# EAGLE design gsm_module (EAGLE 6.4)
PARTNAME: gsm_module; REVISION: 3.0
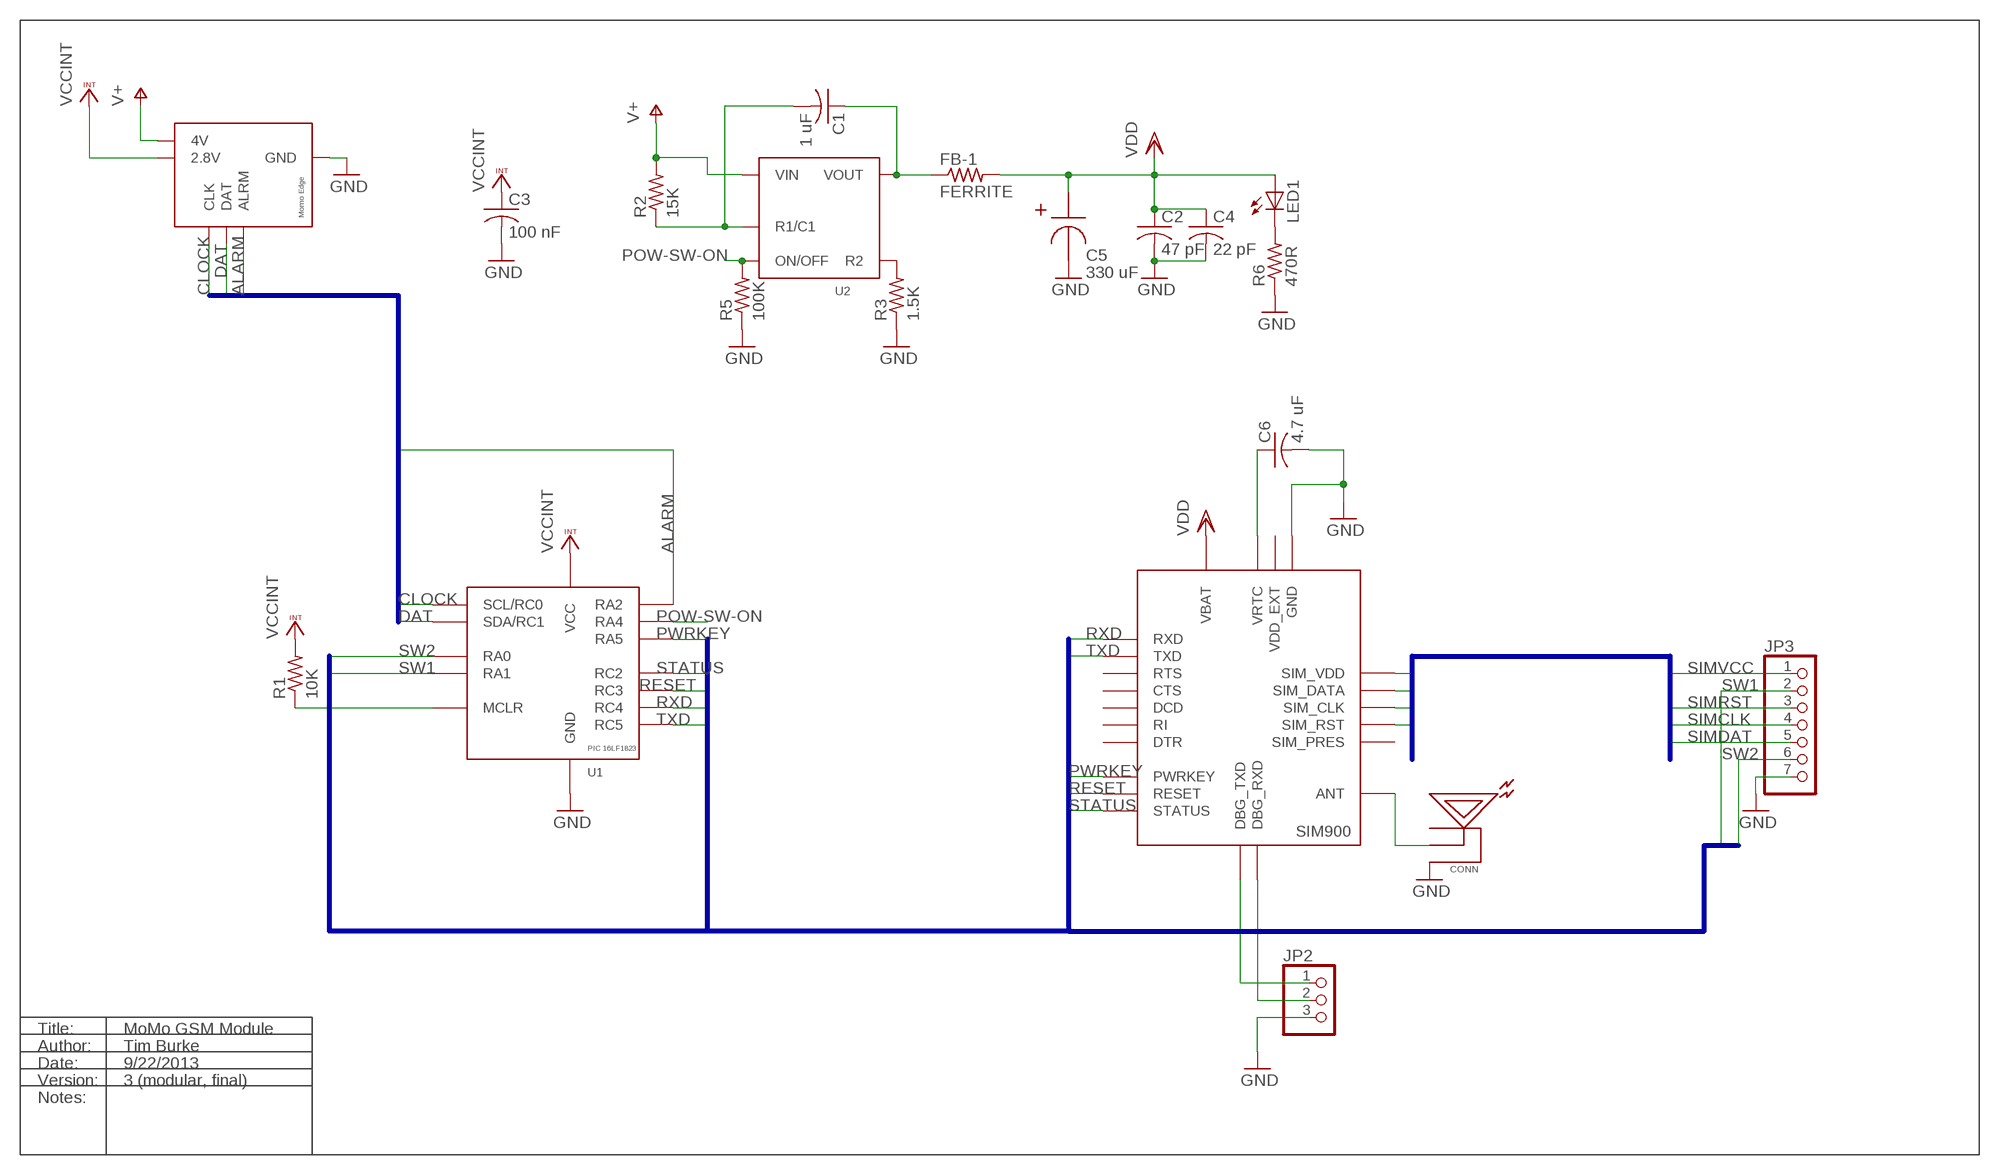
[diagram p0: schematic, sheet 1]

## Parts
C1  1 uF  C-USC0402K  [C0402K]
C2  47 pF  C-USC0402K  [C0402K]
C3  100 nF  C-USC0402  [C0402]
C4  22 pF  C-USC0402K  [C0402K]
C5  330 uF  TANTALUM_CAP  [2917]
C6  4.7 uF  C-USC0805  [C0805]
CONN  RFANTENNA  [RFJACK]
FB-1  FERRITE  R-US_R0805  [R0805]
JP1  MOMO-EDGE-6M  [MOMO-EDGE-6M]
JP2  PINHD-1X3  [1X03]
JP3  PINHD-1X7  [1X07]
LED1  LEDCHIPLED_0603  [CHIPLED_0603]
R1  10K  R-US_R0603  [R0603]
R2  15K  R-US_R0603  [R0603]
R3  1.5K  R-US_R0603  [R0603]
R5  100K  R-US_R0603  [R0603]
R6  470R  R-US_R0603  [R0603]
U1  PIC16LF1823  [SO14]
U2  TI-HIGHSIDE-PFET  [SOT23-6L]
U3  SIM900  [SIM900]

## Nets
ALARM: JP1.ALARM(ALRM) U1.11(RA2)
CLOCK: JP1.CLK U1.10(SCL/RC0)
DAT: JP1.DAT U1.9(SDA/RC1)
DEBUGRX: JP2.2 U3.28(DBG_RXD)
DEBUGTX: JP2.1 U3.27(DBG_TXD)
GND: C2.2 C3.2 C4.2 C5.- C6.2 CONN.UNUSED1(SHIELD) CONN.UNUSED2(SHIELD) JP1.GND JP2.3 JP3.7 R3.1 R5.1 R6.1 U1.14(GND) U3.17(GND) U3.18(GND) U3.29(GND) U3.39(GND) U3.45(GND) U3.46(GND) U3.53(GND) U3.54(GND) U3.58(GND) U3.59(GND) U3.61(GND) U3.62(GND) U3.63(GND) U3.64(GND) U3.65(GND)
N$1: R3.2 U2.1(R2)
N$2: LED1.C R6.2
N$3: C1.2 R2.1 U2.6(R1/C1)
N$4: C1.1 FB-1.1 U2.2(VOUT) U2.3(VOUT)
N$5: C6.1 U3.26(VRTC)
N$6: R1.1 U1.4(MCLR)
N$7: CONN.ANTENNA(PIN) U3.60(ANT)
POW-SW-ON: R5.2 U1.3(RA4) U2.5(ON/OFF)
PWRKEY: U1.2(RA5) U3.1(PWRKEY)
RESET: U1.7(RC3) U3.16(RESET)
RXD: U1.6(RC4) U3.10(RXD)
SIMCLK: JP3.4 U3.32(SIM_CLK)
SIMDAT: JP3.5 U3.31(SIM_DATA)
SIMRST: JP3.3 U3.33(SIM_RST)
SIMVCC: JP3.1 U3.30(SIM_VDD)
STATUS: U1.8(RC2) U3.66(STATUS)
SW1: JP3.2 U1.12(RA1)
SW2: JP3.6 U1.13(RA0)
TXD: U1.5(RC5) U3.9(TXD)
V+: JP1.4V R2.2 U2.4(VIN)
VCCINT: C3.1 JP1.V28(2.8V) R1.2 U1.1(VCC)
VDD: C2.1 C4.1 C5.+ FB-1.2 LED1.A U3.55(VBAT) U3.56(VBAT) U3.57(VBAT)
Unconnected: U3.3(DTR) U3.4(RI) U3.5(DCD) U3.7(CTS) U3.8(RTS) U3.34(SIM_PRES)

## Buses
MIB:CLOCK,DAT,PMCLR,ALARM
SIMBUS:SIMVCC,SIMCLK,SIMDAT,SIMRST
SIM900CONN:RXD,TXD,PWRKEY,RESET,STATUS,SW1,SW2

## Notes on the sheet
- Title: | MoMo GSM Module
- Author: | Tim Burke
- Date: | 9/22/2013
- Version: | 3 (modular, final)
- Notes:

## Power pins joined to a net without a drawn wire
VDD_EXT: U3.15(VDD_EXT)

## Library data of the parts
C1 = rcl:C-US: CAPACITOR, American symbol; DIGIKEY-PN: 445-4114-1-ND
C2 = rcl:C-US: CAPACITOR, American symbol; DIGIKEY-PN: 445-1243-1-ND
C3 = rcl:C-US: CAPACITOR, American symbol; DIGIKEY-PN: 445-1265-1-ND
C4 = rcl:C-US: CAPACITOR, American symbol; DIGIKEY-PN: 445-1239-1-ND
C5 = components:TANTALUM_CAP; DIGIKEY-PN: 399-4053-1-ND
C6 = rcl:C-US: CAPACITOR, American symbol; DIGIKEY-PN: 1276-1259-1-ND
CONN = components:RFANTENNA; DIGIKEY-PN: J983CT-ND
FB-1 = rcl:R-US_: RESISTOR, American symbol; DIGIKEY-PN: 445-1567-1-ND
JP1 = components:MOMO-EDGE-6M; DIGIKEY-PN: 609-3327-ND
JP2 = pinhead:PINHD-1X3: PIN HEADER
JP3 = pinhead:PINHD-1X7: PIN HEADER
LED1 = led:LED: LED OSRAM: - CHIPLED LG R971, LG N971, LY N971, LG Q971, LY Q971, LO R971, LY R971 LH N974, LH R974 LS Q976, LO Q976, LY Q976 LO Q996 - Hyper CHIPLED LW Q18S LB Q993, LB Q99A, LB R99A - SideLED LS A670, LO A670, LY A670, LG A670, LP A670 LB A673, LV A673, LT A673, LW A673 LH A674 LY A675 LS A676, LA A676, LO A676, LY A676, LW A676 LS A679, LY A679, LG A679 - Hyper Micro SIDELED® LS Y876, LA Y876, LO Y876, LY Y876 LT Y87S - SmartLED LW L88C, LW L88S LB L89C, LB L89S, LG L890 LS L89K, LO L89K, LY L89K LS L896, LA L896, LO L896, LY L896 - TOPLED LS T670, LO T670, LY T670, LG T670, LP T670 LSG T670, LSP T670, LSY T670, LOP T670, LYG T670 LG T671, LOG T671, LSG T671 LB T673, LV T673, LT T673, LW T673 LH T674 LS T676, LA T676, LO T676, LY T676, LB T676, LH T676, LSB T676, LW T676 LB T67C, LV T67C, LT T67C, LS T67K, LO T67K, LY T67K, LW E67C LS E67B, LA E67B, LO E67B, LY E67B, LB E67C, LV E67C, LT E67C LW T67C LS T679, LY T679, LG T679 LS T770, LO T770, LY T770, LG T770, LP T770 LB T773, LV T773, LT T773, LW T773 LH T774 LS E675, LA E675, LY E675, LS T675 LS T776, LA T776, LO T776, LY T776, LB T776 LHGB T686 LT T68C, LB T68C - Hyper Mini TOPLED® LB M676 - Mini TOPLED Santana® LG M470 LS M47K, LO M47K, LY M47K Source: http://www.osram.convergy.de LUXEON: - LUMILED® LXK2-PW12-R00, LXK2-PW12-S00, LXK2-PW14-U00, LXK2-PW14-V00 LXK2-PM12-R00, LXK2-PM12-S00, LXK2-PM14-U00 LXK2-PE12-Q00, LXK2-PE12-R00, LXK2-PE12-S00, LXK2-PE14-T00, LXK2-PE14-U00 LXK2-PB12-K00, LXK2-PB12-L00, LXK2-PB12-M00, LXK2-PB14-N00, LXK2-PB14-P00, LXK2-PB14-Q00 LXK2-PR12-L00, LXK2-PR12-M00, LXK2-PR14-Q00, LXK2-PR14-R00 LXK2-PD12-Q00, LXK2-PD12-R00, LXK2-PD12-S00 LXK2-PH12-R00, LXK2-PH12-S00 LXK2-PL12-P00, LXK2-PL12-Q00, LXK2-PL12-R00 Source: www.luxeon.com KINGBRIGHT: KA-3528ASYC Source: www.kingbright.com; DIGIKEY-PN: 475-2709-1-ND
R1 = rcl:R-US_: RESISTOR, American symbol; DIGIKEY-PN: P10.0KHCT-ND
R2 = rcl:R-US_: RESISTOR, American symbol; DIGIKEY-PN: P15KGCT-ND
R3 = rcl:R-US_: RESISTOR, American symbol; DIGIKEY-PN: P1.5KGCT-ND
R5 = rcl:R-US_: RESISTOR, American symbol; DIGIKEY-PN: P100KHCT-ND
R6 = rcl:R-US_: RESISTOR, American symbol
U1 = components:PIC16LF1823; DIGIKEY-PN: PIC16LF1823-I/SL-ND
U2 = components:TI-HIGHSIDE-PFET; DIGIKEY-PN: 296-34970-1-ND
U3 = components:SIM900

## Board
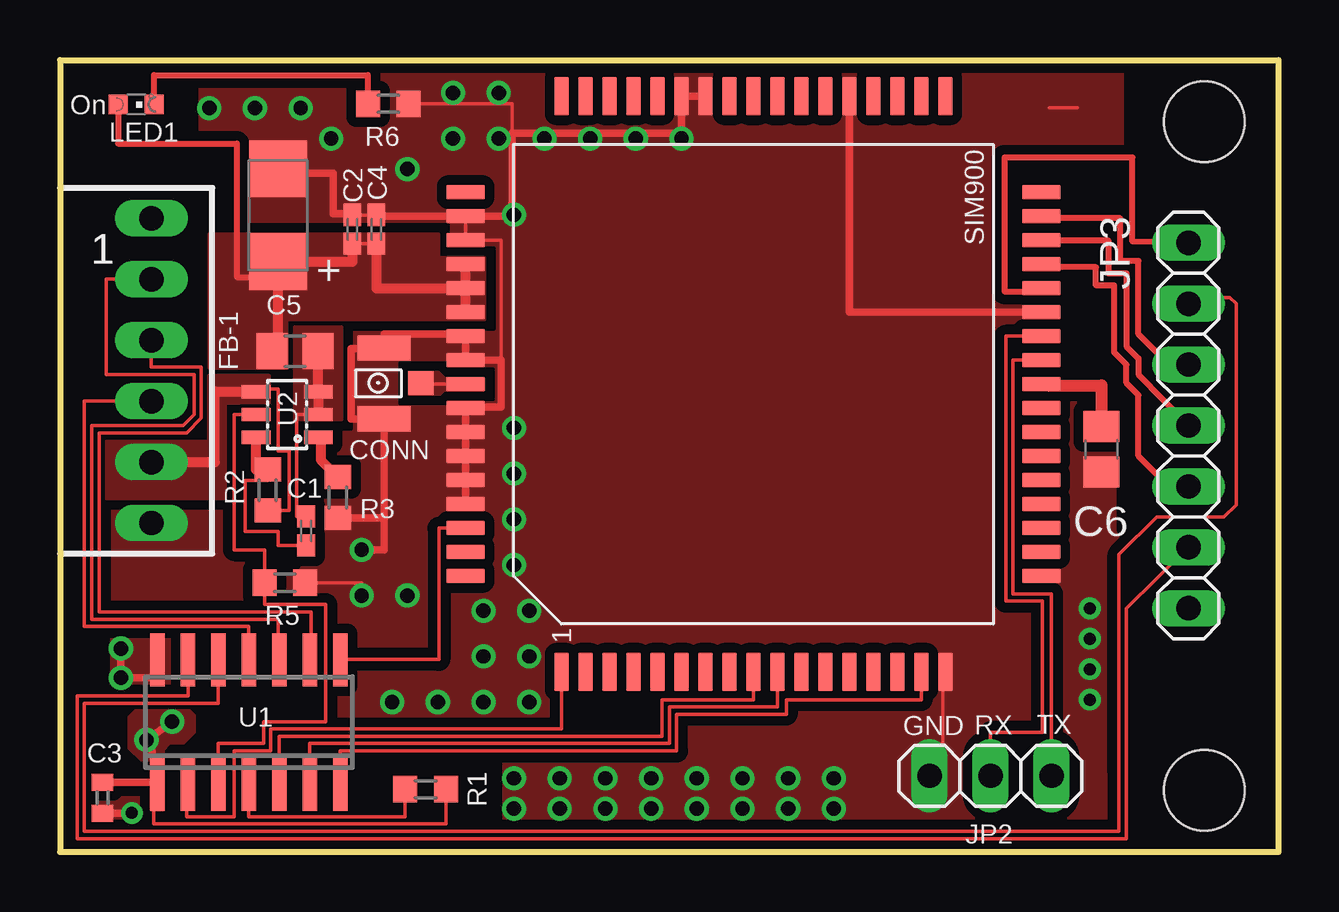
[diagram p1: board, top side]
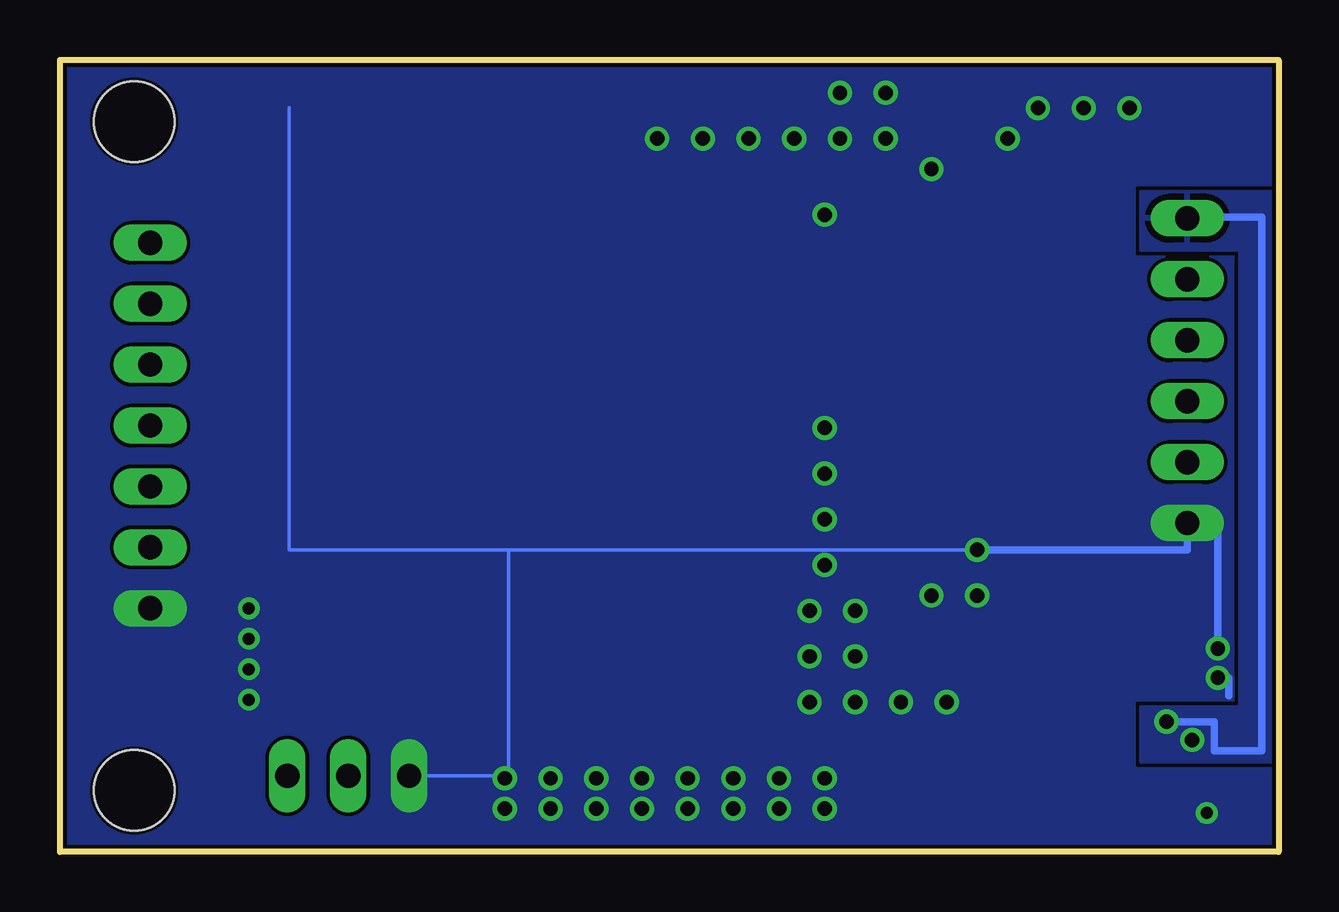
[diagram p2: board, bottom side, seen from below]

Size 50.8 x 33.02 mm. Coordinates in mm from the lower left corner, seen from the top.
Outline: 0,33.02 0,0 50.8,0 50.8,33.02 0,33.02
Copper layers (1*16): Top 0.035mm / dielectric 1.5mm / Bottom 0.035mm
Design rules "default *": minimum track width 6mil, minimum drill 19mil, track to track 6mil, track to pad 6mil, pad to pad 6mil, via to via 6mil, smd to smd 6mil, copper to edge 6mil, drill to drill 8mil, minimum pad ring 10mil, minimum via ring 8mil, stop-mask expansion 4mil, vias tented up to drill 0mil, thermal gap 10mil
Holes 3.35 mm at 47.7,30.45 47.7,2.57
tRestrict: area 41.8,22.1 to 42.2,22.9; area 44.5,13.5 to 45.5,16.9; area 17.7,1.3 to 18,3.8; area 1.4,6.9 to 1.7,9; area 9.1,12.1 to 9.7,12.3; area 5,30 to 5.3,31.9

### Footprints (pad centres in the part's own frame; a part is rotated, then mirrored left to right if it is on the bottom)
C0402K = smd 0.925 x 0.74: 1 -0.6,0; 2 0.6,0
C0402 = smd 0.7 x 0.9: 1 -0.65,0; 2 0.65,0
2917 = smd 2.37 x 2.43: + 1.935,0; - -1.935,0
C0805 = smd 1.3 x 1.5: 1 -0.95,0; 2 0.95,0
RFJACK = smd 1.05 x 1: ANTENNA 2.795,1.488 | smd 2.2 x 1.05: UNUSED1 1.27,2.953; UNUSED2 1.27,0
R0805 = smd 1.3 x 1.5: 1 -0.95,0; 2 0.95,0
MOMO-EDGE-6M = drill 1.016 long: 4V 0,0; ALARM 0,2.54; CLK 0,7.62; DAT 0,5.08; GND 0,-2.54; V28 0,10.16
1X03 = drill 1.016 long: 1 -2.54,0; 2 0,0; 3 2.54,0
1X07 = drill 1.016 long: 1 -7.62,0; 2 -5.08,0; 3 -2.54,0; 4 0,0; 5 2.54,0; 6 5.08,0; 7 7.62,0
CHIPLED_0603 = smd 0.8 x 0.8: A 0,-0.75; C 0,0.75
R0603 = smd 1 x 1.1: 1 -0.85,0; 2 0.85,0
SO14 = smd 0.6 x 2.2: 1 -3.81,-2.6; 2 -2.54,-2.6; 3 -1.27,-2.6; 4 0,-2.6; 5 1.27,-2.6; 6 2.54,-2.6; 7 3.81,-2.6; 8 3.81,2.6; 9 2.54,2.6; 10 1.27,2.6; 11 0,2.6; 12 -1.27,2.6; 13 -2.54,2.6; 14 -3.81,2.6
SOT23-6L = smd 0.55 x 1.2: 1 -0.95,-1.3; 2 0,-1.3; 3 0.95,-1.3; 4 0.95,1.3; 5 0,1.3; 6 -0.95,1.3
SIM900 = smd 1.6 x 0.6: 1 -12,8; 2 -12,7; 3 -12,6; 4 -12,5; 5 -12,4; 6 -12,3; 7 -12,2; 8 -12,1; 9 -12,0; 10 -12,-1; 11 -12,-2; 12 -12,-3; 13 -12,-4; 14 -12,-5; 15 -12,-6; 16 -12,-7; 17 -12,-8; 35 12,-8; 36 12,-7; 37 12,-6; 38 12,-5; 39 12,-4; 40 12,-3; 41 12,-2; 42 12,-1; 43 12,0; 44 12,1; 45 12,2; 46 12,3; 47 12,4; 48 12,5; 49 12,6; 50 12,7; 51 12,8 | smd 0.6 x 1.6: 18 -8,-12; 19 -7,-12; 20 -6,-12; 21 -5,-12; 22 -4,-12; 23 -3,-12; 24 -2,-12; 25 -1,-12; 26 0,-12; 27 1,-12; 28 2,-12; 29 3,-12; 30 4,-12; 31 5,-12; 32 6,-12; 33 7,-12; 34 8,-12; 52 8,12; 53 7,12; 54 6,12; 55 5,12; 56 4,12; 57 3,12; 58 2,12; 59 1,12; 60 0,12; 61 -1,12; 62 -2,12; 63 -3,12; 64 -4,12; 65 -5,12; 66 -6,12; 67 -7,12; 68 -8,12

### Placement (x,y rotation side)
C1  10.26,13.39 270 top
C2  12.19,25.96 90 top
C3  1.78,2.26 270 top
C4  13.18,25.96 90 top
C5  9.09,26.54 270 top
C6  43.41,16.79 270 top
CONN  12.24,18.06 0 top
FB-1  9.8,20.88 180 top
JP1  3.81,16.26 0 top
JP2  38.79,3.18 180 top
JP3  47.04,17.78 270 top
LED1  3.18,31.17 270 top
R1  15.24,2.62 0 top
R2  8.66,15.09 270 top
R3  11.58,14.78 90 top
R5  9.37,11.23 180 top
R6  13.69,31.19 180 top
U1  7.87,5.41 0 top
U2  9.47,18.24 90 top
U3  28.91,19.51 90 top

### Tracks (layer width: path | path; a pad name or v marks a point on that pad's centre or on a via)
ALARM
  Top 0.152: JP1.ALARM 1.02,18.8 1.02,9.4 7.87,9.4 U1.11
CLOCK
  Top 0.152: JP1.CLK 1.93,23.88 1.93,19.91 5.59,19.91 5.59,18.24 5.13,17.78 1.32,17.78 1.32,17.63 1.32,9.7 9.09,9.7 9.09,8.01 U1.10
DAT
  Top 0.152: JP1.DAT 3.81,20.22 5.89,20.22 5.89,18.09 5.28,17.48 1.63,17.48 1.63,17.32 1.63,10.01 10.46,10.01 10.46,8.01 U1.9
DEBUGRX
  Top 0.152: U3.28 39.42,21.51 39.42,10.46 40.95,10.46 40.95,4.98 38.79,4.98 JP2.2
DEBUGTX
  Top 0.152: U3.27 39.73,20.51 39.73,10.77 41.33,10.77 JP2.1
GND  (via drill 0.5, 0.6)
  Top 0.152: C2.2 C4.2 | 42.41,31.04 41.25,31.04 | U3.53 U3.54 18.39,25.51 18.39,20.51 | U3.17 36.8,7.51 36.8,4.5 36.25,4.5 JP2.3 | R6.1 18.85,31.19 18.85,29.97 | R5.1 12.57,11.23 v12.57,10.69
  Top 0.305: U1.14 4.06,7.26 v2.54,7.26 v2.54,8.48 | C5.- 9.09,28.3 11.38,28.3 11.38,26.62 12.19,26.62 C2.2 | C4.2 13.18,26.51 U3.53 18.85,26.51 18.85,29.97 25.91,29.97 U3.46 U3.45 | U3.39 32.91,22.51 U3.29 | U3.65 U3.64 U3.63 U3.62 U3.61 16.91,18.54 18.39,18.54 18.39,20.51 U3.59 U3.58 16.91,21.59 13.51,21.59 CONN.UNUSED1 13.51,20.98 12.14,20.98 12.14,18.06 CONN.UNUSED2 13.51,13.93 | 13.51,13.93 R3.1 | v12.57,12.6 13.51,12.6 13.51,13.93 | C3.2 3,1.61 v3,1.63
  Bottom 0.152: 41.25,31.04 41.25,12.6 32.11,12.6 | 32.11,12.6 v12.57,12.6 | JP2.3 32.11,3.18 32.11,12.6
  Bottom 0.305: v2.54,7.26 2.08,7.26 2.08,6.5 | v2.54,8.48 2.54,13.72 JP1.GND 3.81,12.6 v12.57,12.6
  other vias: 14.48,10.69 17.65,10.06 19.56,10.06 19.56,8.15 17.65,8.15 17.65,6.25 19.56,6.25 15.75,6.25 13.84,6.25 18.92,1.8 18.92,3.07 20.83,3.07 20.83,1.8 22.73,1.8 22.73,3.07 24.64,3.07 24.64,1.8 26.54,3.07 26.54,1.8 28.45,3.07 28.45,1.8 14.48,28.47 16.38,31.65 18.29,31.65 18.29,29.74 16.38,29.74 6.22,31.01 8.13,31.01 10.03,31.01 11.3,29.74 30.35,3.07 30.35,1.8 32.26,3.07 32.26,1.8 18.92,11.96 18.92,13.87 18.92,15.77 18.92,17.68 18.92,26.57 20.19,29.74 22.1,29.74 24,29.74 25.91,29.74 42.93,10.16 42.93,8.89 42.93,7.62 42.93,6.35
  pour Bottom (rank 4, no thermals): 0.2,32.82 0.18,0.18 50.85,-0.05 50.88,33.1
  pour Top (isolate 0.406, rank 3, no thermals): 0.18,0.18 0.25,33.02 44.27,32.84 44.25,0.2
N$1
  Top 0.152: R3.2 11.51,15.63
  Top 0.406: U2.1 10.87,17.29 10.87,16.34 R3.2
N$2
  Top 0.254: LED1.C 3.93,32.39 12.83,32.39 12.83,31.19 R6.2
N$3
  Top 0.152: U2.6 7.64,17.29 | 8.38,15.67 R2.1 | R2.1 8.17,15.67 | C1.2 9.09,12.79 9.09,13.36 7.72,13.36 7.72,15.49 8.66,15.49 R2.1
  Top 0.406: R2.1 8.17,15.94 U2.6
N$4
  Top 0.152: C1.1 9.86,13.99 9.86,18.24 U2.2
  Top 0.406: U2.2 U2.3 10.75,19.19 FB-1.1
  pour Top (no thermals): 9.78,21.89 9.78,18.03 11.66,18.03 11.73,18.03 11.73,21.87 11.73,21.89
N$5
  Top 0.406: U3.26 41.17,19.51 41.17,19.46
  Top 0.508: 41.17,19.46 43.41,19.46 C6.1
N$6
  Top 0.152: 8.08,2.95 8.08,2.81 U1.4 7.87,1.47 14.39,1.47 R1.1
N$7
  Top 0.152: CONN.ANTENNA 15.04,19.51 U3.60
  pour Top (isolate 0.254, no thermals): 17.65,19.74 16.03,19.74 15.77,19.99 14.58,19.99 14.58,19.1 15.85,19.1 16,19.25 17.65,19.25
POW-SW-ON
  Top 0.152: U1.3 6.6,4.52 8.48,4.52 8.48,5.44 11.07,5.44 11.07,10.31 8.52,10.31 R5.2 8.52,12.6 7.26,12.6 7.26,18.24 U2.5
PWRKEY
  Top 0.152: U1.2 5.28,2.81 5.28,1.47 7.26,1.47 7.26,4.22 8.79,4.22 8.79,5.13 20.91,5.13 U3.1
RESET
  Top 0.152: U3.16 35.91,6.35 30.28,6.35 30.28,5.74 25.7,5.74 25.7,4.22 11.68,4.22 U1.7
RXD
  Top 0.152: U3.10 29.91,6.04 25.4,6.04 25.4,4.52 10.41,4.52 U1.6
SIMCLK
  Top 0.254: U3.32 43.69,25.51 43.69,24.13 44.45,24.13 44.45,21.34 44.45,21.08 44.96,20.57 44.96,19.91 JP3.4
SIMDAT
  Top 0.254: JP3.5 46.18,15.29 44.96,16.51 44.96,19.05 44.45,19.56 44.45,20.32 43.94,20.83 43.94,23.62 43.18,23.62 43.18,24.38 40.91,24.38 U3.31
SIMRST
  Top 0.254: JP3.3 46.18,20.37 44.96,21.59 44.96,24.64 44.2,24.64 44.2,26.42 40.91,26.42 U3.33
SIMVCC
  Top 0.254: JP3.1 44.7,25.45 44.7,28.96 39.37,28.96 39.37,23.37 40.91,23.37 U3.30
STATUS
  Top 0.152: U3.66 15.8,13.51 15.8,8.03 11.68,8.03 U1.8
SW1
  Top 0.152: U1.12 6.6,6.2 1.02,6.2 1.02,0.86 44.15,0.86 44.15,3.3 44.15,12.4 45.72,13.97 48.51,13.97 49.02,14.48 49.02,22.86 48.77,23.11 47.24,23.11 JP3.2
SW2
  Top 0.152: U1.13 5.33,6.5 0.71,6.5 0.71,0.56 44.45,0.56 44.45,3 44.45,10.16 JP3.6
TXD
  Top 0.152: U3.9 28.91,6.35 25.09,6.35 25.09,4.83 24.64,4.83 24.33,4.83 9.14,4.83 U1.5
V+
  Top 0.152: R2.2 9.55,14.24 9.55,16.71 9.09,16.71 9.09,19.3 8.17,19.3 U2.4
  Top 0.406: JP1.4V 6.45,16.26 6.45,19.2 8.17,19.2 U2.4
  pour Top (no thermals): 1.93,17.12 1.93,14.73 6.88,14.73 6.88,18.72 8.71,18.72 8.71,19.86 6.2,19.86 6.2,17.12
VCCINT  (via drill 0.6)
  Top 0.152: R1.2 16.09,1.17 3.91,1.17 3.91,2.66 U1.1
  Top 0.305: v4.67,5.44 v3.61,4.67 3.76,4.67 U1.1 4.06,2.91 C3.1
  Bottom 0.305: v4.67,5.44 2.69,5.44 2.69,4.22 0.71,4.22 0.71,26.47 3.81,26.47 JP1.V28
  pour Top (no thermals): 4.29,1.75 4.29,4.27 4.57,4.55 5.16,4.55 5.59,4.98 5.59,5.69 5.33,5.94 3.2,5.94 2.9,5.64 2.9,4.32 3.38,3.84 3.81,3.84 3.81,1.75
  pour Bottom (no thermals): 2.51,3.84 5.71,3.84 5.71,5.92 2.51,5.92
  pour Bottom (rank 2): -0.05,3.76 5.74,3.76 5.74,6.05 1.63,6.05 1.63,25.1 5.74,25.1 5.74,27.53 -0.05,27.53
VDD
  Top 0.152: C2.1 C4.1
  Top 0.254: LED1.A 2.42,29.54 7.37,29.54 7.37,23.98 9.09,23.98
  Top 0.406: FB-1.2 9.09,20.88 9.09,23.98 C5.+ 12.19,24.61 C2.1 | U3.57 U3.56 | U3.56 U3.55 | C4.1 13.18,23.51 U3.56
  pour Top (no thermals): 17.7,24.79 17.7,22.2 9.45,22.2 9.45,20.17 6.22,20.17 6.22,25.76 15.77,25.76 15.77,24.79

### Text on the board
tPlace: On | GND | RX | TX